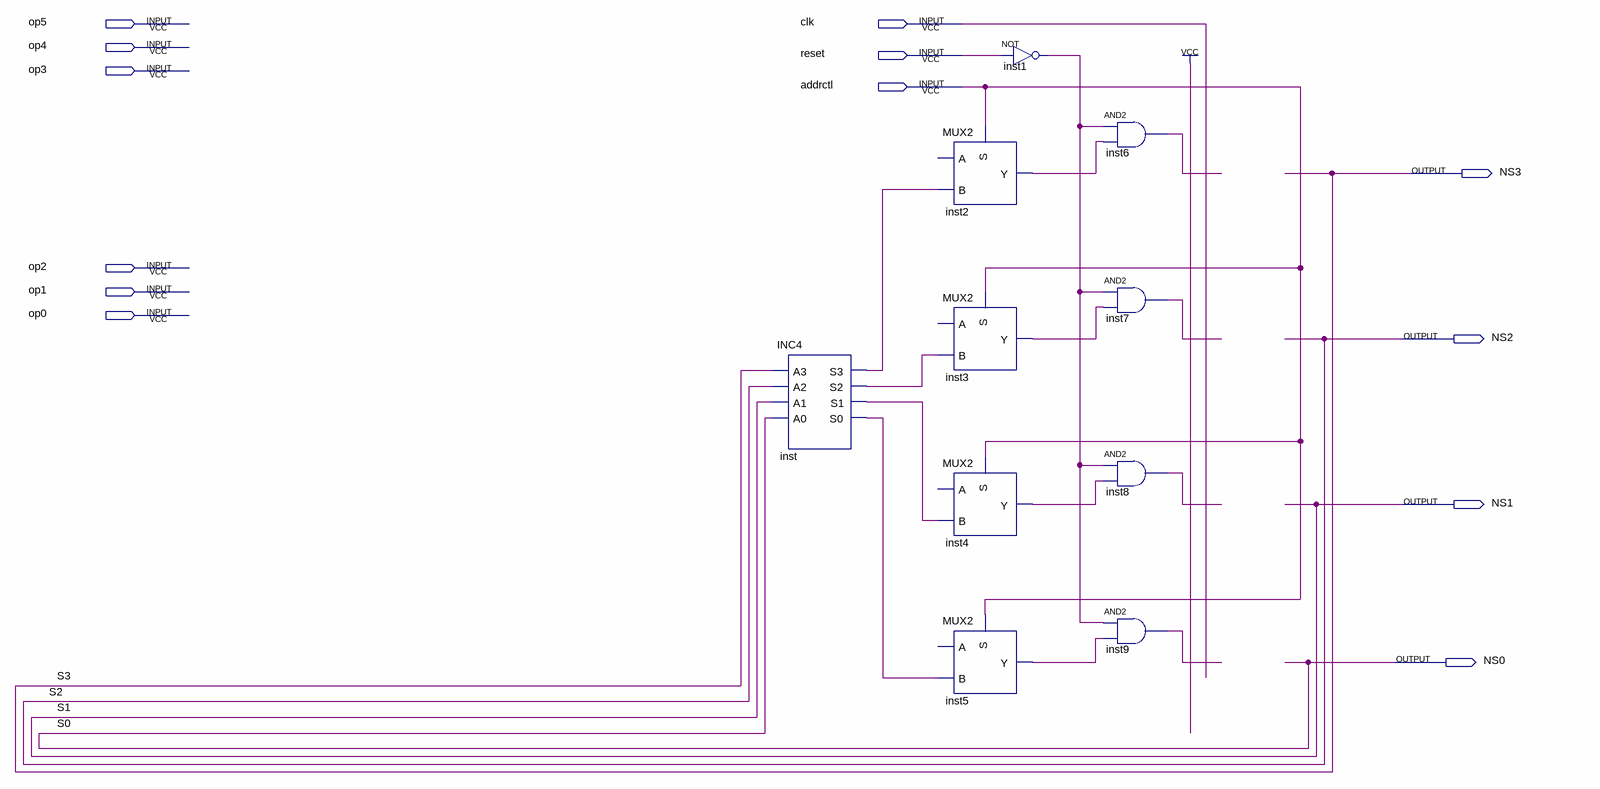
[diagram p0: schematic sheet]
// Quartus schematic FSM.bdf as structural Verilog: 10 symbols, 13 pins
module FSM (
  input  op5,
  input  clk,
  input  op4,
  input  reset,
  input  op3,
  input  addrctl,
  input  op2,
  input  op1,
  input  op0,
  output NS3,
  output NS2,
  output NS1,
  output NS0
);

  wire inst1_out, inst2_y, inst3_y, inst4_y, inst5_y, inst6_out, inst7_out, inst8_out, inst9_out, inst_s0,
       inst_s1, inst_s2, inst_s3;

  INC4 inst (.A3(NS3), .A2(NS2), .A1(NS1), .A0(NS0), .S3(inst_s3), .S2(inst_s2), .S1(inst_s1), .S0(inst_s0));
  MUX2 inst2 (.S(addrctl), .B(inst_s3), .Y(inst2_y));  // open: A
  MUX2 inst3 (.S(addrctl), .B(inst_s2), .Y(inst3_y));  // open: A
  MUX2 inst4 (.S(addrctl), .B(inst_s1), .Y(inst4_y));  // open: A
  MUX2 inst5 (.S(addrctl), .B(inst_s0), .Y(inst5_y));  // open: A
  not inst1 (inst1_out, reset);
  and inst6 (inst6_out, inst1_out, inst2_y);
  and inst7 (inst7_out, inst1_out, inst3_y);
  and inst8 (inst8_out, inst1_out, inst4_y);
  and inst9 (inst9_out, inst1_out, inst5_y);

  // Other names for the same wires on the sheet: S0 = NS0; S1 = NS1; S2 = NS2; S3 = NS3
endmodule
